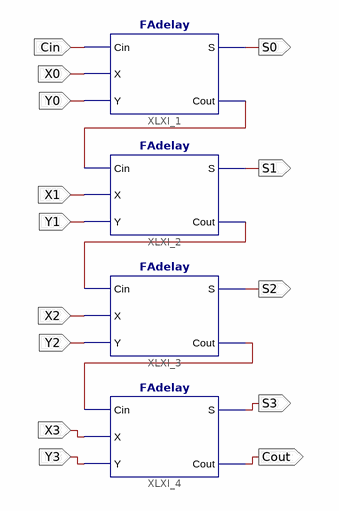
[diagram p0: schematic sheet 1]
// Xilinx ISE schematic RCA4B.sch (spartan6) as structural Verilog: 4 symbols, 14 ports
module RCA4B (
  input  Cin,
  input  X0,
  input  Y0,
  input  X1,
  input  Y1,
  input  X2,
  input  Y2,
  input  X3,
  input  Y3,
  output S0,
  output S1,
  output S2,
  output S3,
  output Cout
);

  wire XLXN_1, XLXN_2, XLXN_3;

  FAdelay XLXI_1 (.Cin(Cin), .X(X0), .Y(Y0), .S(S0), .Cout(XLXN_1));
  FAdelay XLXI_2 (.Cin(XLXN_1), .X(X1), .Y(Y1), .S(S1), .Cout(XLXN_2));
  FAdelay XLXI_3 (.Cin(XLXN_2), .X(X2), .Y(Y2), .S(S2), .Cout(XLXN_3));
  FAdelay XLXI_4 (.Cin(XLXN_3), .X(X3), .Y(Y3), .S(S3), .Cout(Cout));
endmodule
